# Altium schematic sheet 1_BLOCK.SchDoc
size 420 x 297 mm; SheetNumber: 1; SheetTotal: 4
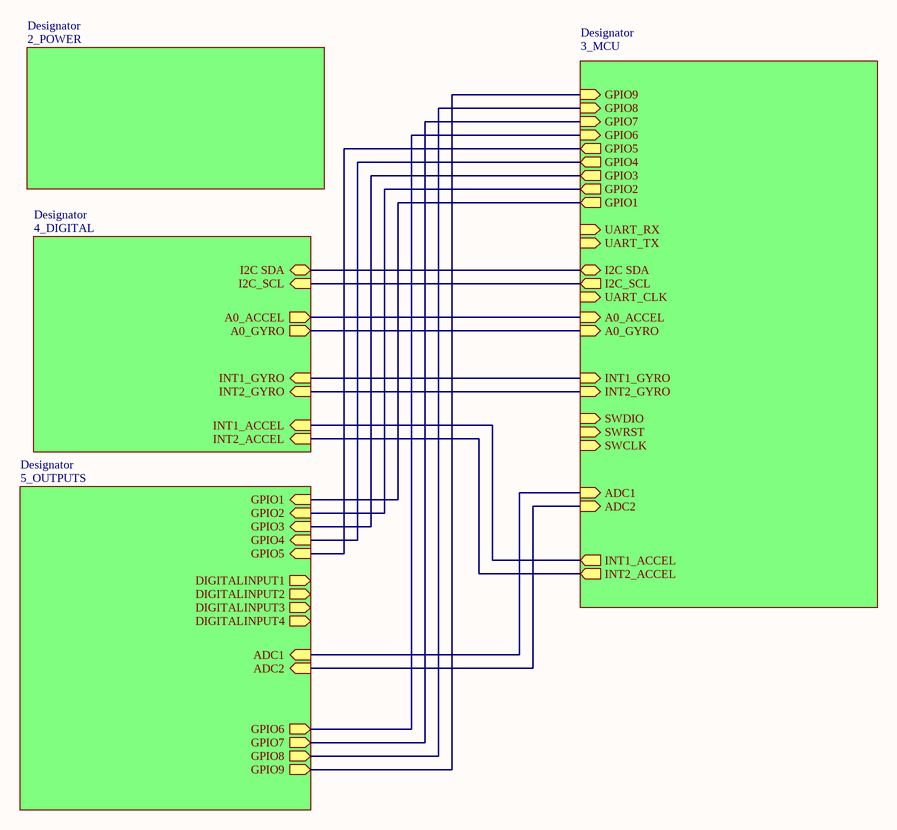
[diagram p0: 1_BLOCK.SchDoc]

## Sub-sheets
Designator = 3_MCU: GPIO1 (out), GPIO2 (out), GPIO3 (out), GPIO4 (out), GPIO5 (out), GPIO6 (in), GPIO7 (in), GPIO8 (in), GPIO9 (in), SWDIO (in), I2C SDA (bidir), I2C_SCL (out), UART_CLK (in), A0_ACCEL (in), A0_GYRO (in), INT1_GYRO (in), INT2_GYRO (in), SWRST (in), UART_TX (in), UART_RX (in), ADC1 (in), ADC2 (in), SWCLK (in), INT1_ACCEL (out), INT2_ACCEL (out)
Designator = 4_DIGITAL: I2C_SCL (in), A0_ACCEL (out), A0_GYRO (out), INT1_GYRO (in), INT2_GYRO (in), I2C SDA (bidir), INT1_ACCEL (in), INT2_ACCEL (in)
Designator = 5_OUTPUTS: GPIO1 (in), GPIO2 (in), GPIO3 (in), GPIO4 (in), GPIO5 (in), GPIO6 (out), GPIO7 (out), GPIO8 (out), GPIO9 (out), DIGITALINPUT1 (out), DIGITALINPUT2 (out), DIGITALINPUT3 (out), DIGITALINPUT4 (out), ADC1 (in), ADC2 (in)
Designator = 2_POWER: no entries

## Nets
(unnamed): sheet Designator/GPIO1, sheet Designator/GPIO1
(unnamed): sheet Designator/GPIO2, sheet Designator/GPIO2
(unnamed): sheet Designator/GPIO3, sheet Designator/GPIO3
(unnamed): sheet Designator/GPIO4, sheet Designator/GPIO4
(unnamed): sheet Designator/GPIO5, sheet Designator/GPIO5
(unnamed): sheet Designator/GPIO6, sheet Designator/GPIO6
(unnamed): sheet Designator/GPIO7, sheet Designator/GPIO7
(unnamed): sheet Designator/GPIO8, sheet Designator/GPIO8
(unnamed): sheet Designator/GPIO9, sheet Designator/GPIO9
(unnamed): sheet Designator/I2C SDA, sheet Designator/I2C SDA
(unnamed): sheet Designator/I2C_SCL, sheet Designator/I2C_SCL
(unnamed): sheet Designator/A0_ACCEL, sheet Designator/A0_ACCEL
(unnamed): sheet Designator/A0_GYRO, sheet Designator/A0_GYRO
(unnamed): sheet Designator/INT1_GYRO, sheet Designator/INT1_GYRO
(unnamed): sheet Designator/INT2_GYRO, sheet Designator/INT2_GYRO
(unnamed): sheet Designator/ADC1, sheet Designator/ADC1
(unnamed): sheet Designator/ADC2, sheet Designator/ADC2
(unnamed): sheet Designator/INT1_ACCEL, sheet Designator/INT1_ACCEL
(unnamed): sheet Designator/INT2_ACCEL, sheet Designator/INT2_ACCEL

## Notes on the sheet
- THIS DOCUMENT AND THE DATA DISCLOSED HEREIN OR
- HEREWITH IS THE PROPERTY OF ALTIUM LIMITED AND MAY
- DWG NO:
- REVISION
- REV:
- DESCRIPTION
- DATE
- APPROVED
- BE FREELY DISTRIBUTED IN WHOLE. NO RIGHTS ARE
- RESERVED OR EXPRESS OR IMPLIED WARANTEE GIVEN.
- ENG:
- APPROVALS
- PROJECT
- DSN:
- CHK:
- REFERENCE DOCUMENTS
- PROJECT REVISION:
- TITLE
- DOCUMENT REVISION:
- DESIGN ITEM:
- BOM:
- FAB DWG:
- PCB DWG:
- ASSY DWG:
- SCALE:
- A3
- SIZE
- CAGE CODE
- FILE NAME
- DWG NO.
- SHEET
- OF
- REV